# Altium schematic sheet Hall_sensor.SchDoc
size A4
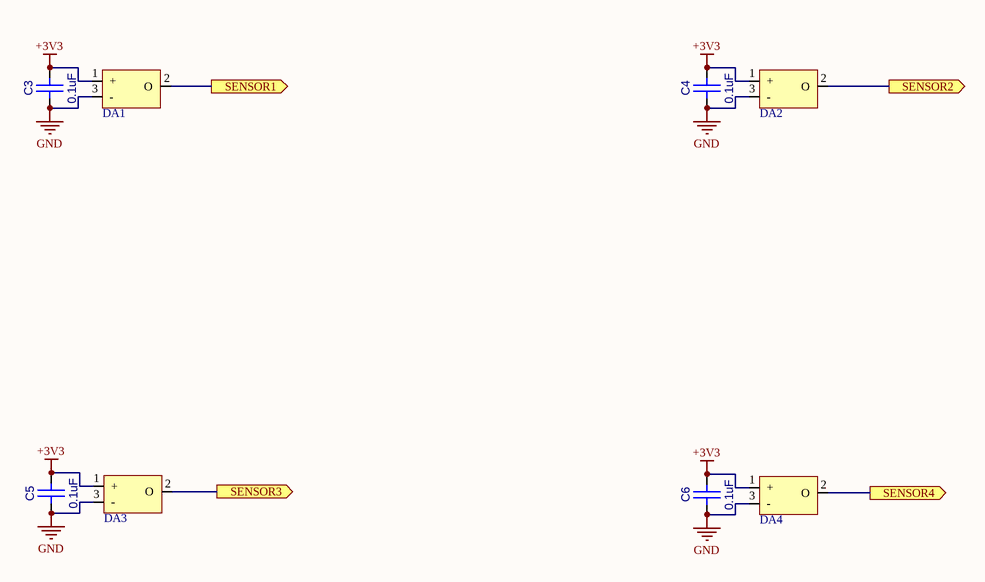
[diagram p0: Hall_sensor.SchDoc]

## Parts
C3  0.1uF  [CC0603]
C4  0.1uF  [CC0603]
C5  0.1uF  [CC0603]
C6  0.1uF  [CC0603]
DA1  DRV5033AJQDBZR  [SOT-23(123)]  (value not drawn)
DA2  DRV5033AJQDBZR  [SOT-23(123)]  (value not drawn)
DA3  DRV5033AJQDBZR  [SOT-23(123)]  (value not drawn)
DA4  DRV5033AJQDBZR  [SOT-23(123)]  (value not drawn)

## Ports
SENSOR1 (out), SENSOR2 (out), SENSOR3 (out), SENSOR4 (out)

## Nets
+3V3: C3.2(B) C4.2(B) C5.2(B) C6.2(B) DA1.1(+) DA2.1(+) DA3.1(+) DA4.1(+)
GND: C3.1(A) C4.1(A) C5.1(A) C6.1(A) DA1.3(-) DA2.3(-) DA3.3(-) DA4.3(-)
SENSOR1: DA1.2(O) ; port SENSOR1
SENSOR2: DA2.2(O) ; port SENSOR2
SENSOR3: DA3.2(O) ; port SENSOR3
SENSOR4: DA4.2(O) ; port SENSOR4

## Library data of the parts
C3-C6 = CC0603: Value: 0.1uF
DA1-DA4 = DRV5033: Hall sensor; Value: DRV5033AJQDBZR